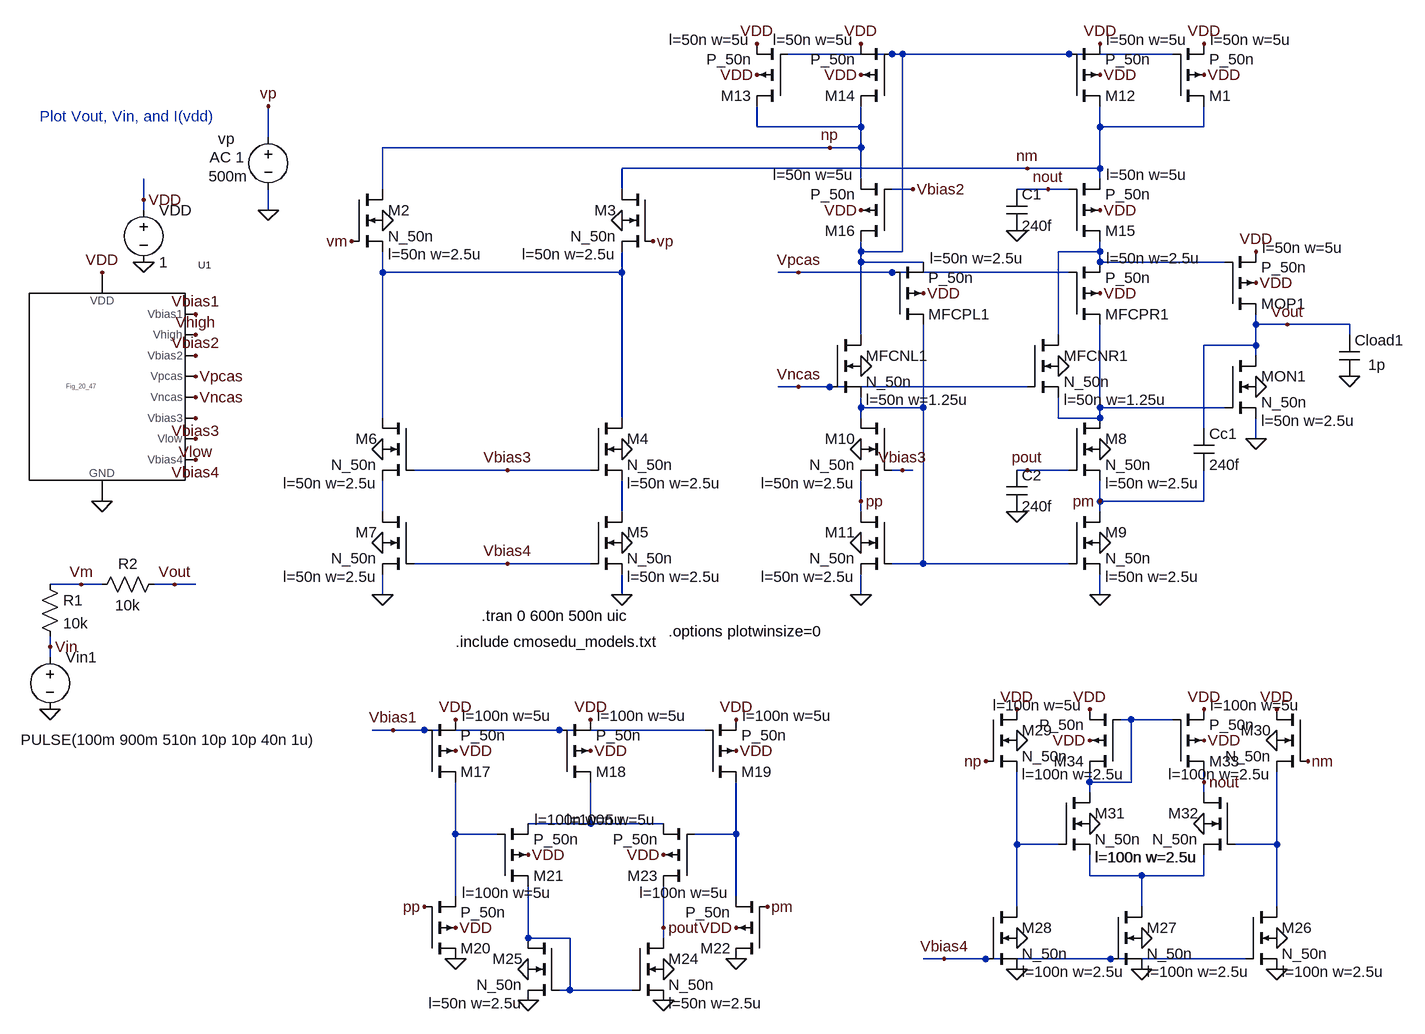
[diagram p0: schematic Fig24_53_tran.asc]
Fig24_53_tran.asc, the LTspice schematic file:
Version 4
SHEET 1 3376 680
WIRE 2512 -1200 2352 -1200
WIRE 2528 -1200 2512 -1200
WIRE 2784 -1200 2528 -1200
WIRE 2944 -1200 2784 -1200
WIRE 2304 -1088 2304 -1120
WIRE 2464 -1088 2464 -1120
WIRE 2464 -1088 2304 -1088
WIRE 2832 -1088 2832 -1120
WIRE 2992 -1088 2992 -1120
WIRE 2992 -1088 2832 -1088
WIRE 1552 -1072 1552 -1120
WIRE 2416 -1056 1728 -1056
WIRE 2464 -1056 2464 -1088
WIRE 2464 -1056 2416 -1056
WIRE 2720 -1024 2096 -1024
WIRE 2832 -1024 2832 -1088
WIRE 2832 -1024 2720 -1024
WIRE 2464 -1008 2464 -1056
WIRE 2832 -1008 2832 -1024
WIRE 1728 -992 1728 -1056
WIRE 2096 -992 2096 -1024
WIRE 2544 -992 2512 -992
WIRE 2752 -992 2704 -992
WIRE 2784 -992 2752 -992
WIRE 1360 -976 1360 -1008
WIRE 1360 -960 1360 -976
WIRE 1552 -960 1552 -992
WIRE 2464 -896 2464 -912
WIRE 2528 -896 2528 -1200
WIRE 2528 -896 2464 -896
WIRE 2832 -896 2832 -912
WIRE 2832 -896 2768 -896
WIRE 2464 -880 2464 -896
WIRE 2560 -880 2464 -880
WIRE 2832 -880 2832 -896
WIRE 3024 -880 2832 -880
WIRE 1728 -864 1728 -896
WIRE 2096 -864 2096 -896
WIRE 2096 -864 1728 -864
WIRE 2368 -864 2336 -864
WIRE 2512 -864 2368 -864
WIRE 2784 -864 2512 -864
WIRE 3072 -784 3072 -800
WIRE 3120 -784 3072 -784
WIRE 3216 -784 3120 -784
WIRE 2464 -768 2464 -880
WIRE 2768 -768 2768 -896
WIRE 3216 -768 3216 -784
WIRE 3072 -752 3072 -784
WIRE 3072 -752 2992 -752
WIRE 3072 -736 3072 -752
WIRE 2368 -688 2336 -688
WIRE 2416 -688 2368 -688
WIRE 2720 -688 2416 -688
WIRE 2464 -656 2464 -672
WIRE 2560 -656 2560 -784
WIRE 2560 -656 2464 -656
WIRE 2832 -656 2832 -784
WIRE 3024 -656 2832 -656
WIRE 1728 -640 1728 -864
WIRE 2096 -640 2096 -864
WIRE 2464 -640 2464 -656
WIRE 2768 -640 2768 -672
WIRE 2832 -640 2832 -656
WIRE 2832 -640 2768 -640
WIRE 2992 -624 2992 -752
WIRE 3072 -608 3072 -640
WIRE 1920 -560 1776 -560
WIRE 2048 -560 1920 -560
WIRE 2528 -560 2512 -560
WIRE 2544 -560 2528 -560
WIRE 2720 -560 2704 -560
WIRE 2784 -560 2720 -560
WIRE 2464 -512 2464 -544
WIRE 2832 -512 2832 -544
WIRE 2992 -512 2992 -560
WIRE 2992 -512 2832 -512
WIRE 1728 -496 1728 -544
WIRE 2096 -496 2096 -544
WIRE 2464 -496 2464 -512
WIRE 2832 -496 2832 -512
WIRE 1920 -416 1776 -416
WIRE 2048 -416 1920 -416
WIRE 2560 -416 2560 -656
WIRE 2560 -416 2512 -416
WIRE 2784 -416 2560 -416
WIRE 1264 -384 1216 -384
WIRE 1296 -384 1264 -384
WIRE 1408 -384 1376 -384
WIRE 1440 -384 1408 -384
WIRE 1728 -368 1728 -400
WIRE 2096 -368 2096 -400
WIRE 2464 -368 2464 -400
WIRE 2832 -368 2832 -400
WIRE 1216 -288 1216 -304
WIRE 1216 -272 1216 -288
WIRE 2880 -176 2864 -176
WIRE 2944 -176 2880 -176
WIRE 1744 -160 1712 -160
WIRE 1792 -160 1744 -160
WIRE 2000 -160 1792 -160
WIRE 2224 -160 2000 -160
WIRE 2816 -80 2816 -96
WIRE 2880 -80 2880 -176
WIRE 2880 -80 2816 -80
WIRE 2992 -80 2992 -96
WIRE 2816 -64 2816 -80
WIRE 2992 -64 2992 -80
WIRE 2048 -16 2048 -80
WIRE 2048 -16 1952 -16
WIRE 2160 -16 2048 -16
WIRE 1840 0 1840 -80
WIRE 1904 0 1840 0
WIRE 2272 0 2272 -80
WIRE 2272 0 2208 0
WIRE 2704 16 2704 -96
WIRE 2768 16 2704 16
WIRE 3104 16 3104 -96
WIRE 3104 16 3040 16
WIRE 2816 64 2816 32
WIRE 2896 64 2816 64
WIRE 2992 64 2992 32
WIRE 2992 64 2896 64
WIRE 1840 96 1840 0
WIRE 2272 96 2272 0
WIRE 2704 112 2704 16
WIRE 2896 112 2896 64
WIRE 3104 112 3104 16
WIRE 2160 144 2160 80
WIRE 1952 160 1952 80
WIRE 2016 160 1952 160
WIRE 2160 160 2160 144
WIRE 2592 192 2560 192
WIRE 2656 192 2592 192
WIRE 2848 192 2656 192
WIRE 3056 192 2848 192
WIRE 2016 240 2016 160
WIRE 2016 240 2000 240
WIRE 2112 240 2016 240
FLAG 1360 -880 0
FLAG 1360 -976 VDD
FLAG 1296 -864 VDD
FLAG 1296 -512 0
FLAG 1440 -800 Vbias1
FLAG 1440 -768 Vhigh
FLAG 1440 -736 Vbias2
FLAG 1440 -640 Vbias3
FLAG 1440 -704 Vpcas
FLAG 1440 -672 Vncas
FLAG 1440 -576 Vbias4
FLAG 1440 -608 Vlow
FLAG 1552 -960 0
FLAG 1552 -1120 vp
FLAG 1216 -192 0
FLAG 1408 -384 Vout
FLAG 1264 -384 Vm
FLAG 1216 -288 Vin
FLAG 1840 -128 VDD
FLAG 1840 -176 VDD
FLAG 2048 -128 VDD
FLAG 2048 -176 VDD
FLAG 2272 -128 VDD
FLAG 2272 -176 VDD
FLAG 1744 -160 Vbias1
FLAG 1840 144 VDD
FLAG 1952 32 VDD
FLAG 2272 144 VDD
FLAG 2160 32 VDD
FLAG 2160 208 0
FLAG 1952 208 0
FLAG 1952 256 0
FLAG 2160 256 0
FLAG 2272 192 0
FLAG 1840 192 0
FLAG 1792 112 pp
FLAG 2320 112 pm
FLAG 2160 144 pout
FLAG 3104 160 0
FLAG 3104 208 0
FLAG 2896 160 0
FLAG 2896 208 0
FLAG 2704 160 0
FLAG 2704 208 0
FLAG 2592 192 Vbias4
FLAG 2704 -144 0
FLAG 3104 -144 0
FLAG 2704 -192 VDD
FLAG 3104 -192 VDD
FLAG 2656 -112 np
FLAG 3152 -112 nm
FLAG 2816 -16 0
FLAG 2992 -16 0
FLAG 2992 -144 VDD
FLAG 2992 -192 VDD
FLAG 2816 -144 VDD
FLAG 2816 -192 VDD
FLAG 2992 -80 nout
FLAG 2992 -1168 VDD
FLAG 1728 -944 0
FLAG 2096 -944 0
FLAG 1680 -912 vm
FLAG 2144 -912 vp
FLAG 2096 -592 0
FLAG 2096 -448 0
FLAG 2096 -368 0
FLAG 1728 -592 0
FLAG 1728 -448 0
FLAG 1728 -368 0
FLAG 1920 -560 Vbias3
FLAG 1920 -416 Vbias4
FLAG 2832 -592 0
FLAG 2832 -448 0
FLAG 2832 -368 0
FLAG 2464 -592 0
FLAG 2464 -448 0
FLAG 2464 -368 0
FLAG 2528 -560 Vbias3
FLAG 2832 -1168 VDD
FLAG 2832 -1216 VDD
FLAG 2992 -1216 VDD
FLAG 2304 -1168 VDD
FLAG 2464 -1168 VDD
FLAG 2464 -1216 VDD
FLAG 2304 -1216 VDD
FLAG 2832 -960 VDD
FLAG 2464 -960 VDD
FLAG 2544 -992 Vbias2
FLAG 3216 -704 0
FLAG 3120 -784 Vout
FLAG 2560 -832 VDD
FLAG 2832 -832 VDD
FLAG 2768 -720 0
FLAG 2464 -720 0
FLAG 2368 -864 Vpcas
FLAG 2368 -688 Vncas
FLAG 3072 -848 VDD
FLAG 3072 -896 VDD
FLAG 3072 -688 0
FLAG 3072 -608 0
FLAG 2752 -992 nout
FLAG 2720 -1024 nm
FLAG 2416 -1056 np
FLAG 2720 -560 pout
FLAG 2832 -512 pm
FLAG 2464 -512 pp
FLAG 2704 -928 0
FLAG 2704 -496 0
SYMBOL voltage 1360 -976 R0
WINDOW 123 0 0 Left 2
WINDOW 39 0 0 Left 2
SYMATTR InstName VDD
SYMATTR Value 1
SYMBOL Fig_20_47 1296 -688 R0
SYMATTR InstName U1
SYMBOL voltage 1552 -1088 R0
WINDOW 0 -77 18 Left 2
WINDOW 3 -92 76 Left 2
WINDOW 123 -90 47 Left 2
WINDOW 39 0 0 Left 2
SYMATTR InstName vp
SYMATTR Value 500m
SYMATTR Value2 AC 1
SYMBOL voltage 1216 -288 R0
WINDOW 3 -45 143 Left 2
WINDOW 123 0 0 Left 2
WINDOW 39 0 0 Left 2
SYMATTR Value PULSE(100m 900m 510n 10p 10p 40n 1u)
SYMATTR InstName Vin1
SYMBOL res 1200 -400 R0
SYMATTR InstName R1
SYMATTR Value 10k
SYMBOL res 1280 -368 R270
WINDOW 0 32 56 VTop 2
WINDOW 3 0 56 VBottom 2
SYMATTR InstName R2
SYMATTR Value 10k
SYMBOL pmos4 1792 -80 M180
WINDOW 123 58 102 Left 2
WINDOW 0 56 16 Left 2
SYMATTR Value2 l=100n w=5u
SYMATTR InstName M17
SYMATTR Value P_50n
SYMBOL pmos4 2000 -80 M180
WINDOW 123 58 102 Left 2
WINDOW 0 56 16 Left 2
SYMATTR Value2 l=100n w=5u
SYMATTR InstName M18
SYMATTR Value P_50n
SYMBOL pmos4 2224 -80 M180
WINDOW 123 58 102 Left 2
WINDOW 0 56 16 Left 2
SYMATTR Value2 l=100n w=5u
SYMATTR InstName M19
SYMATTR Value P_50n
SYMBOL pmos4 1792 192 M180
WINDOW 123 58 102 Left 2
WINDOW 0 56 16 Left 2
SYMATTR Value2 l=100n w=5u
SYMATTR InstName M20
SYMATTR Value P_50n
SYMBOL pmos4 1904 80 M180
WINDOW 123 58 102 Left 2
WINDOW 0 56 16 Left 2
SYMATTR Value2 l=100n w=5u
SYMATTR InstName M21
SYMATTR Value P_50n
SYMBOL pmos4 2320 192 R180
WINDOW 123 58 102 Left 2
WINDOW 0 56 16 Left 2
SYMATTR Value2 l=100n w=5u
SYMATTR InstName M22
SYMATTR Value P_50n
SYMBOL pmos4 2208 80 R180
WINDOW 123 58 102 Left 2
WINDOW 0 56 16 Left 2
SYMATTR Value2 l=100n w=5u
SYMATTR InstName M23
SYMATTR Value P_50n
SYMBOL nmos4 2112 160 R0
WINDOW 123 56 100 Left 2
SYMATTR Value2 l=50n w=2.5u
SYMATTR InstName M24
SYMATTR Value N_50n
SYMBOL nmos4 2000 160 M0
WINDOW 123 56 100 Left 2
SYMATTR Value2 l=50n w=2.5u
SYMATTR InstName M25
SYMATTR Value N_50n
SYMBOL nmos4 3056 112 R0
WINDOW 123 56 100 Left 2
SYMATTR Value2 l=100n w=2.5u
SYMATTR InstName M26
SYMATTR Value N_50n
SYMBOL nmos4 2848 112 R0
WINDOW 123 56 100 Left 2
SYMATTR Value2 l=100n w=2.5u
SYMATTR InstName M27
SYMATTR Value N_50n
SYMBOL nmos4 2656 112 R0
WINDOW 123 56 100 Left 2
SYMATTR Value2 l=100n w=2.5u
SYMATTR InstName M28
SYMATTR Value N_50n
SYMBOL nmos4 2656 -192 R0
WINDOW 123 56 100 Left 2
SYMATTR Value2 l=100n w=2.5u
SYMATTR InstName M29
SYMATTR Value N_50n
SYMBOL nmos4 3152 -192 M0
WINDOW 123 56 100 Left 2
SYMATTR Value2 l=100n w=2.5u
SYMATTR InstName M30
SYMATTR Value N_50n
SYMBOL nmos4 2768 -64 R0
WINDOW 123 56 100 Left 2
SYMATTR Value2 l=100n w=2.5u
SYMATTR InstName M31
SYMATTR Value N_50n
SYMBOL nmos4 3040 -64 M0
WINDOW 123 56 100 Left 2
SYMATTR Value2 l=100n w=2.5u
SYMATTR InstName M32
SYMATTR Value N_50n
SYMBOL pmos4 2944 -96 M180
WINDOW 123 58 102 Left 2
WINDOW 0 56 16 Left 2
SYMATTR Value2 l=100n w=5u
SYMATTR InstName M33
SYMATTR Value P_50n
SYMBOL pmos4 2864 -96 R180
WINDOW 123 58 102 Left 2
WINDOW 0 56 16 Left 2
SYMATTR Value2 l=100n w=5u
SYMATTR InstName M34
SYMATTR Value P_50n
SYMBOL pmos4 2944 -1120 M180
WINDOW 123 58 102 Left 2
WINDOW 0 56 16 Left 2
SYMATTR Value2 l=50n w=5u
SYMATTR InstName M1
SYMATTR Value P_50n
SYMBOL nmos4 1680 -992 R0
WINDOW 123 56 100 Left 2
SYMATTR Value2 l=50n w=2.5u
SYMATTR InstName M2
SYMATTR Value N_50n
SYMBOL nmos4 2144 -992 M0
WINDOW 123 56 100 Left 2
SYMATTR Value2 l=50n w=2.5u
SYMATTR InstName M3
SYMATTR Value N_50n
SYMBOL nmos4 2048 -640 R0
WINDOW 123 56 100 Left 2
SYMATTR Value2 l=50n w=2.5u
SYMATTR InstName M4
SYMATTR Value N_50n
SYMBOL nmos4 2048 -496 R0
WINDOW 123 56 100 Left 2
SYMATTR Value2 l=50n w=2.5u
SYMATTR InstName M5
SYMATTR Value N_50n
SYMBOL nmos4 1776 -640 M0
WINDOW 123 56 100 Left 2
SYMATTR Value2 l=50n w=2.5u
SYMATTR InstName M6
SYMATTR Value N_50n
SYMBOL nmos4 1776 -496 M0
WINDOW 123 56 100 Left 2
SYMATTR Value2 l=50n w=2.5u
SYMATTR InstName M7
SYMATTR Value N_50n
SYMBOL nmos4 2784 -640 R0
WINDOW 123 56 100 Left 2
SYMATTR Value2 l=50n w=2.5u
SYMATTR InstName M8
SYMATTR Value N_50n
SYMBOL nmos4 2784 -496 R0
WINDOW 123 56 100 Left 2
SYMATTR Value2 l=50n w=2.5u
SYMATTR InstName M9
SYMATTR Value N_50n
SYMBOL nmos4 2512 -640 M0
WINDOW 123 56 100 Left 2
SYMATTR Value2 l=50n w=2.5u
SYMATTR InstName M10
SYMATTR Value N_50n
SYMBOL nmos4 2512 -496 M0
WINDOW 123 56 100 Left 2
SYMATTR Value2 l=50n w=2.5u
SYMATTR InstName M11
SYMATTR Value N_50n
SYMBOL pmos4 2784 -1120 M180
WINDOW 123 58 102 Left 2
WINDOW 0 56 16 Left 2
SYMATTR Value2 l=50n w=5u
SYMATTR InstName M12
SYMATTR Value P_50n
SYMBOL pmos4 2352 -1120 R180
WINDOW 123 58 102 Left 2
WINDOW 0 56 16 Left 2
SYMATTR Value2 l=50n w=5u
SYMATTR InstName M13
SYMATTR Value P_50n
SYMBOL pmos4 2512 -1120 R180
WINDOW 123 58 102 Left 2
WINDOW 0 56 16 Left 2
SYMATTR Value2 l=50n w=5u
SYMATTR InstName M14
SYMATTR Value P_50n
SYMBOL pmos4 2784 -912 M180
WINDOW 123 58 102 Left 2
WINDOW 0 56 16 Left 2
SYMATTR Value2 l=50n w=5u
SYMATTR InstName M15
SYMATTR Value P_50n
SYMBOL pmos4 2512 -912 R180
WINDOW 123 58 102 Left 2
WINDOW 0 56 16 Left 2
SYMATTR Value2 l=50n w=5u
SYMATTR InstName M16
SYMATTR Value P_50n
SYMBOL cap 3200 -768 R0
WINDOW 3 45 46 Left 2
SYMATTR Value 1p
SYMATTR InstName Cload1
SYMBOL pmos4 2512 -784 M180
WINDOW 123 58 102 Left 2
WINDOW 0 56 16 Left 2
SYMATTR Value2 l=50n w=2.5u
SYMATTR InstName MFCPL1
SYMATTR Value P_50n
SYMBOL pmos4 2784 -784 M180
WINDOW 123 58 102 Left 2
WINDOW 0 56 16 Left 2
SYMATTR Value2 l=50n w=2.5u
SYMATTR InstName MFCPR1
SYMATTR Value P_50n
SYMBOL nmos4 2720 -768 R0
WINDOW 123 56 100 Left 2
SYMATTR Value2 l=50n w=1.25u
SYMATTR InstName MFCNR1
SYMATTR Value N_50n
SYMBOL nmos4 2416 -768 R0
WINDOW 123 56 100 Left 2
SYMATTR Value2 l=50n w=1.25u
SYMATTR InstName MFCNL1
SYMATTR Value N_50n
SYMBOL pmos4 3024 -800 M180
WINDOW 123 58 102 Left 2
WINDOW 0 56 16 Left 2
SYMATTR Value2 l=50n w=5u
SYMATTR InstName MOP1
SYMATTR Value P_50n
SYMBOL nmos4 3024 -736 R0
WINDOW 123 56 100 Left 2
SYMATTR Value2 l=50n w=2.5u
SYMATTR InstName MON1
SYMATTR Value N_50n
SYMBOL cap 2976 -624 R0
SYMATTR InstName Cc1
SYMATTR Value 240f
SYMBOL cap 2688 -992 R0
SYMATTR InstName C1
SYMATTR Value 240f
SYMBOL cap 2688 -560 R0
SYMATTR InstName C2
SYMATTR Value 240f
TEXT 1840 -296 Left 2 !.include cmosedu_models.txt
TEXT 1880 -336 Left 2 !.tran 0 600n 500n uic
TEXT 1200 -1104 Left 2 ;Plot Vout, Vin, and I(vdd)
TEXT 2168 -312 Left 2 !.options plotwinsize=0

The netlist it stands for:
* Fig24_53_tran.asc
VDD VDD 0 1
XU1 Vbias1 Vhigh Vbias2 Vpcas Vncas Vbias3 Vlow Vbias4 VDD 0 Fig_20_47  ; pins Vbias1 Vhigh Vbias2 Vpcas Vncas Vbias3 Vlow Vbias4 VDD GND
vp vp 0 500m AC 1
Vin1 Vin 0 PULSE(100m 900m 510n 10p 10p 40n 1u)
R1 Vm Vin 10k
R2 Vm Vout 10k
M17 N010 Vbias1 VDD VDD P_50n l=100n w=5u
M18 N009 Vbias1 VDD VDD P_50n l=100n w=5u
M19 N011 Vbias1 VDD VDD P_50n l=100n w=5u
M20 0 pp N010 VDD P_50n l=100n w=5u
M21 N015 N010 N009 VDD P_50n l=100n w=5u
M22 0 pm N011 VDD P_50n l=100n w=5u
M23 pout N011 N009 VDD P_50n l=100n w=5u
M24 pout N015 0 0 N_50n l=50n w=2.5u
M25 N015 N015 0 0 N_50n l=50n w=2.5u
M26 N013 Vbias4 0 0 N_50n l=100n w=2.5u
M27 N014 Vbias4 0 0 N_50n l=100n w=2.5u
M28 N012 Vbias4 0 0 N_50n l=100n w=2.5u
M29 VDD np N012 0 N_50n l=100n w=2.5u
M30 VDD nm N013 0 N_50n l=100n w=2.5u
M31 N008 N012 N014 0 N_50n l=100n w=2.5u
M32 nout N013 N014 0 N_50n l=100n w=2.5u
M33 nout N008 VDD VDD P_50n l=100n w=5u
M34 N008 N008 VDD VDD P_50n l=100n w=5u
M1 nm N001 VDD VDD P_50n l=50n w=5u
M2 np Vm N003 0 N_50n l=50n w=2.5u
M3 nm vp N003 0 N_50n l=50n w=2.5u
M4 N003 Vbias3 N007 0 N_50n l=50n w=2.5u
M5 N007 Vbias4 0 0 N_50n l=50n w=2.5u
M6 N003 Vbias3 N006 0 N_50n l=50n w=2.5u
M7 N006 Vbias4 0 0 N_50n l=50n w=2.5u
M8 N005 pout pm 0 N_50n l=50n w=2.5u
M9 pm N004 0 0 N_50n l=50n w=2.5u
M10 N004 Vbias3 pp 0 N_50n l=50n w=2.5u
M11 pp N004 0 0 N_50n l=50n w=2.5u
M12 nm N001 VDD VDD P_50n l=50n w=5u
M13 np N001 VDD VDD P_50n l=50n w=5u
M14 np N001 VDD VDD P_50n l=50n w=5u
M15 N002 nout nm VDD P_50n l=50n w=5u
M16 N001 Vbias2 np VDD P_50n l=50n w=5u
Cload1 Vout 0 1p
MFCPL1 N004 Vpcas N001 VDD P_50n l=50n w=2.5u
MFCPR1 N005 Vpcas N002 VDD P_50n l=50n w=2.5u
MFCNR1 N002 Vncas N005 0 N_50n l=50n w=1.25u
MFCNL1 N001 Vncas N004 0 N_50n l=50n w=1.25u
MOP1 Vout N002 VDD VDD P_50n l=50n w=5u
MON1 Vout N005 0 0 N_50n l=50n w=2.5u
Cc1 Vout pm 240f
C1 nout 0 240f
C2 pout 0 240f
.model NMOS NMOS
.model PMOS PMOS
.lib standard.mos
.include cmosedu_models.txt
.tran 0 600n 500n uic
* Plot Vout, Vin, and I(vdd)
.options plotwinsize=0
.backanno
.end